# Altium schematic sheet BUS.SchDoc: =GlobalProjectName
size 209 x 297 mm; ApprovedBy: Утвердил; CheckedBy: Проверил; Author: Разработал; SheetNumber: 1; SheetTotal: 1; PageSetup: Record=PageOptions|CenterHorizontal=True|CenterVertical=True|PrintScale=1.00|XCorrection=1.00|YCorrection=1.00|PrintKind=1|BorderSize=5000000|LeftOffset=0|BottomOffset=0|Orientation=2|PaperLength=1000|PaperWidth=1000|Scale=100|PaperSource=15|PrintQuality=1200|MediaType=1|DitherType=10|PaperKind=A3|PrintScaleMode=1; Weight: -; ScaleFactor: -; NormInspection: Норм.Контр.
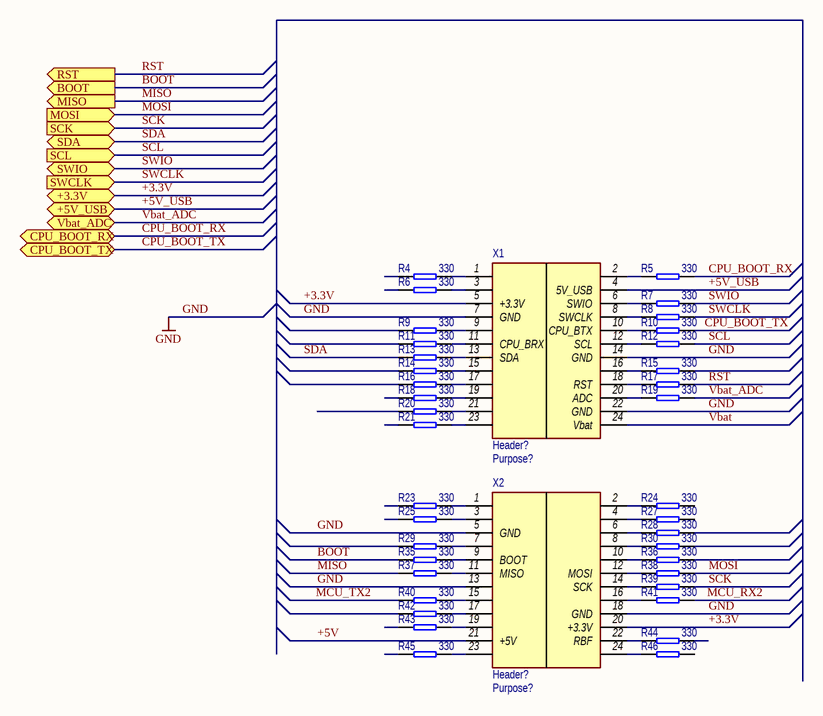
[diagram p0: BUS.SchDoc]

## Parts
R4  value 330  [RES 0402]
R5  value 330  [RES 0402]
R6  value 330  [RES 0402]
R7  value 330  [RES 0402]
R8  value 330  [RES 0402]
R9  value 330  [RES 0402]
R10  value 330  [RES 0402]
R11  value 330  [RES 0402]
R12  value 330  [RES 0402]
R13  value 330  [RES 0402]
R14  value 330  [RES 0402]
R15  value 330  [RES 0402]
R16  value 330  [RES 0402]
R17  value 330  [RES 0402]
R18  value 330  [RES 0402]
R19  value 330  [RES 0402]
R20  value 330  [RES 0402]
R21  value 330  [RES 0402]
R23  value 330  [RES 0402]
R24  value 330  [RES 0402]
R25  value 330  [RES 0402]
R27  value 330  [RES 0402]
R28  value 330  [RES 0402]
R29  value 330  [RES 0402]
R30  value 330  [RES 0402]
R35  value 330  [RES 0402]
R36  value 330  [RES 0402]
R37  value 330  [RES 0402]
R38  value 330  [RES 0402]
R39  value 330  [RES 0402]
R40  value 330  [RES 0402]
R41  value 330  [RES 0402]
R42  value 330  [RES 0402]
R43  value 330  [RES 0402]
R44  value 330  [RES 0402]
R45  value 330  [RES 0402]
R46  value 330  [RES 0402]
X1  Header?  Purpose: Purpose?  [PICOSAT_CNN]
X2  Header?  Purpose: Purpose?  [PICOSAT_CNN]

## Ports
+3.3V (bidir), +5V_USB (bidir), BOOT (out), CPU_BOOT_RX (bidir), CPU_BOOT_TX (bidir), MISO (out), MOSI (in), RST (out), SCK (in), SCL (in), SDA (bidir), SWCLK (in), SWIO (bidir), Vbat_ADC (bidir)

## Nets
GND: X1.7(GND) X1.14(GND) X1.22(GND) X2.5(GND) X2.13 X2.18(GND)
+3.3V: X1.5(+3.3V) X2.20(+3.3V) ; port +3.3V
+5V: X2.21(+5V)
+5V_USB: X1.4(5V_USB) ; port +5V_USB
BOOT: R35.1 ; port BOOT
CPU_BOOT_RX: R5.2 ; port CPU_BOOT_RX
CPU_BOOT_TX: R10.2 ; port CPU_BOOT_TX
MCU_RX2: R41.2
MCU_TX2: R40.1
MISO: R37.1 ; port MISO
MOSI: R38.2 ; port MOSI
RST: R17.2 ; port RST
SCK: R39.2 ; port SCK
SCL: R12.2 ; port SCL
SDA: R13.1 ; port SDA
SWCLK: R8.2 ; port SWCLK
SWIO: R7.2 ; port SWIO
Vbat: X1.24(Vbat)
Vbat_ADC: R19.2 ; port Vbat_ADC
NetR4_2: R4.2 X1.1
NetR5_1: R5.1 X1.2
NetR6_2: R6.2 X1.3
NetR7_1: R7.1 X1.6(SWIO)
NetR8_1: R8.1 X1.8(SWCLK)
NetR9_2: R9.2 X1.9
NetR10_1: R10.1 X1.10(CPU_BTX)
NetR11_2: R11.2 X1.11(CPU_BRX)
NetR12_1: R12.1 X1.12(SCL)
NetR13_2: R13.2 X1.13(SDA)
NetR14_2: R14.2 X1.15
NetR15_1: R15.1 X1.16
NetR16_2: R16.2 X1.17
NetR17_1: R17.1 X1.18(RST)
NetR18_2: R18.2 X1.19
NetR19_1: R19.1 X1.20(ADC)
NetR20_2: R20.2 X1.21
NetR21_2: R21.2 X1.23
NetR23_2: R23.2 X2.1
NetR24_1: R24.1 X2.2
NetR25_2: R25.2 X2.3
NetR27_1: R27.1 X2.4
NetR28_1: R28.1 X2.6
NetR29_2: R29.2 X2.7
NetR30_1: R30.1 X2.8
NetR35_2: R35.2 X2.9(BOOT)
NetR36_1: R36.1 X2.10
NetR37_2: R37.2 X2.11(MISO)
NetR38_1: R38.1 X2.12(MOSI)
NetR39_1: R39.1 X2.14(SCK)
NetR40_2: R40.2 X2.15
NetR41_1: R41.1 X2.16
NetR42_2: R42.2 X2.17
NetR43_2: R43.2 X2.19
NetR44_1: R44.1 X2.22(RBF)
NetR45_2: R45.2 X2.23
NetR46_1: R46.1 X2.24

Not connected (* = marked no-connect by the designer): R4 1(11); R6 1(11); R9 1(11); R11 1(11); R14 1(11); R15 2(12); R16 1(11); R18 1(11); R20 1(11); R21 1(11); R23 1(11); R24 2(12); R25 1(11); R27 2(12); R28 2(12); R29 1(11); R30 2(12); R36 2(12); R42 1(11); R43 1(11); R44 2(12); R45 1(11); R46 2(12)

## Notes on the sheet
- Author
- Manufacturer
- Date
- Page
- Total pages
- Size page
- A3
- Materials

## Library data of the parts
R4-R21 R23-R25 R27-R30 R35-R46 = !Resistor: Resistor; IsSMT: NoSMT
X1 X2 = Header 2x12: 10x2 header; IsSMT: NoSMT